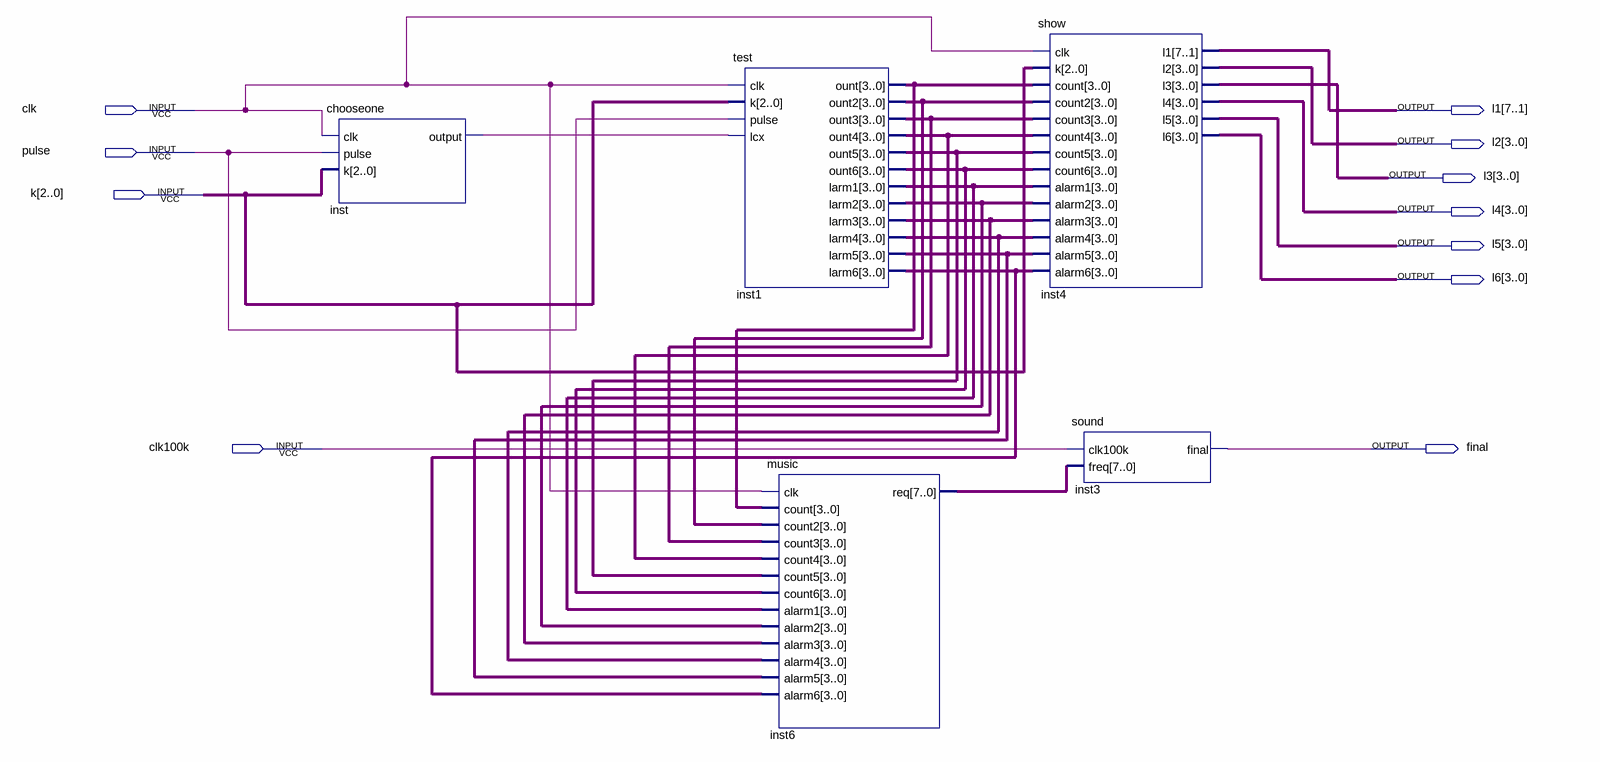
[diagram p0: schematic sheet]
// Quartus schematic Block1.bdf as structural Verilog: 5 symbols, 11 pins
module Block1 (
  input  clk,
  input  pulse,
  input  [2:0] k,
  input  clk100k,
  output [7:1] l1,
  output [3:0] l2,
  output [3:0] l3,
  output [3:0] l4,
  output [3:0] l5,
  output [3:0] l6,
  output \final 
);

  wire inst_output;
  wire [3:0] inst1_larm1, inst1_larm2, inst1_larm3, inst1_larm4, inst1_larm5, inst1_larm6, inst1_ount,
       inst1_ount2, inst1_ount3, inst1_ount4, inst1_ount5, inst1_ount6;
  wire [7:0] inst6_req;

  chooseone inst (.clk(clk), .pulse(pulse), .k(k), .\output (inst_output));
  test inst1 (
    .clk(clk), .k(k), .pulse(pulse), .lcx(inst_output), .ount(inst1_ount), .ount2(inst1_ount2),
    .ount3(inst1_ount3), .ount4(inst1_ount4), .ount5(inst1_ount5), .ount6(inst1_ount6), .larm1(inst1_larm1),
    .larm2(inst1_larm2), .larm3(inst1_larm3), .larm4(inst1_larm4), .larm5(inst1_larm5), .larm6(inst1_larm6));
  music inst6 (
    .clk(clk), .count(inst1_ount), .count2(inst1_ount2), .count3(inst1_ount3), .count4(inst1_ount4),
    .count5(inst1_ount5), .count6(inst1_ount6), .alarm1(inst1_larm1), .alarm2(inst1_larm2),
    .alarm3(inst1_larm3), .alarm4(inst1_larm4), .alarm5(inst1_larm5), .alarm6(inst1_larm6), .req(inst6_req));
  show inst4 (
    .clk(clk), .k(k), .count(inst1_ount), .count2(inst1_ount2), .count3(inst1_ount3), .count4(inst1_ount4),
    .count5(inst1_ount5), .count6(inst1_ount6), .alarm1(inst1_larm1), .alarm2(inst1_larm2),
    .alarm3(inst1_larm3), .alarm4(inst1_larm4), .alarm5(inst1_larm5), .alarm6(inst1_larm6), .l1(l1), .l2(l2),
    .l3(l3), .l4(l4), .l5(l5), .l6(l6));
  sound inst3 (.clk100k(clk100k), .freq(inst6_req), .\final (\final ));
endmodule
